# EAGLE schematic EPS (EAGLE 9.6.2)

## Sheet 1 of 3
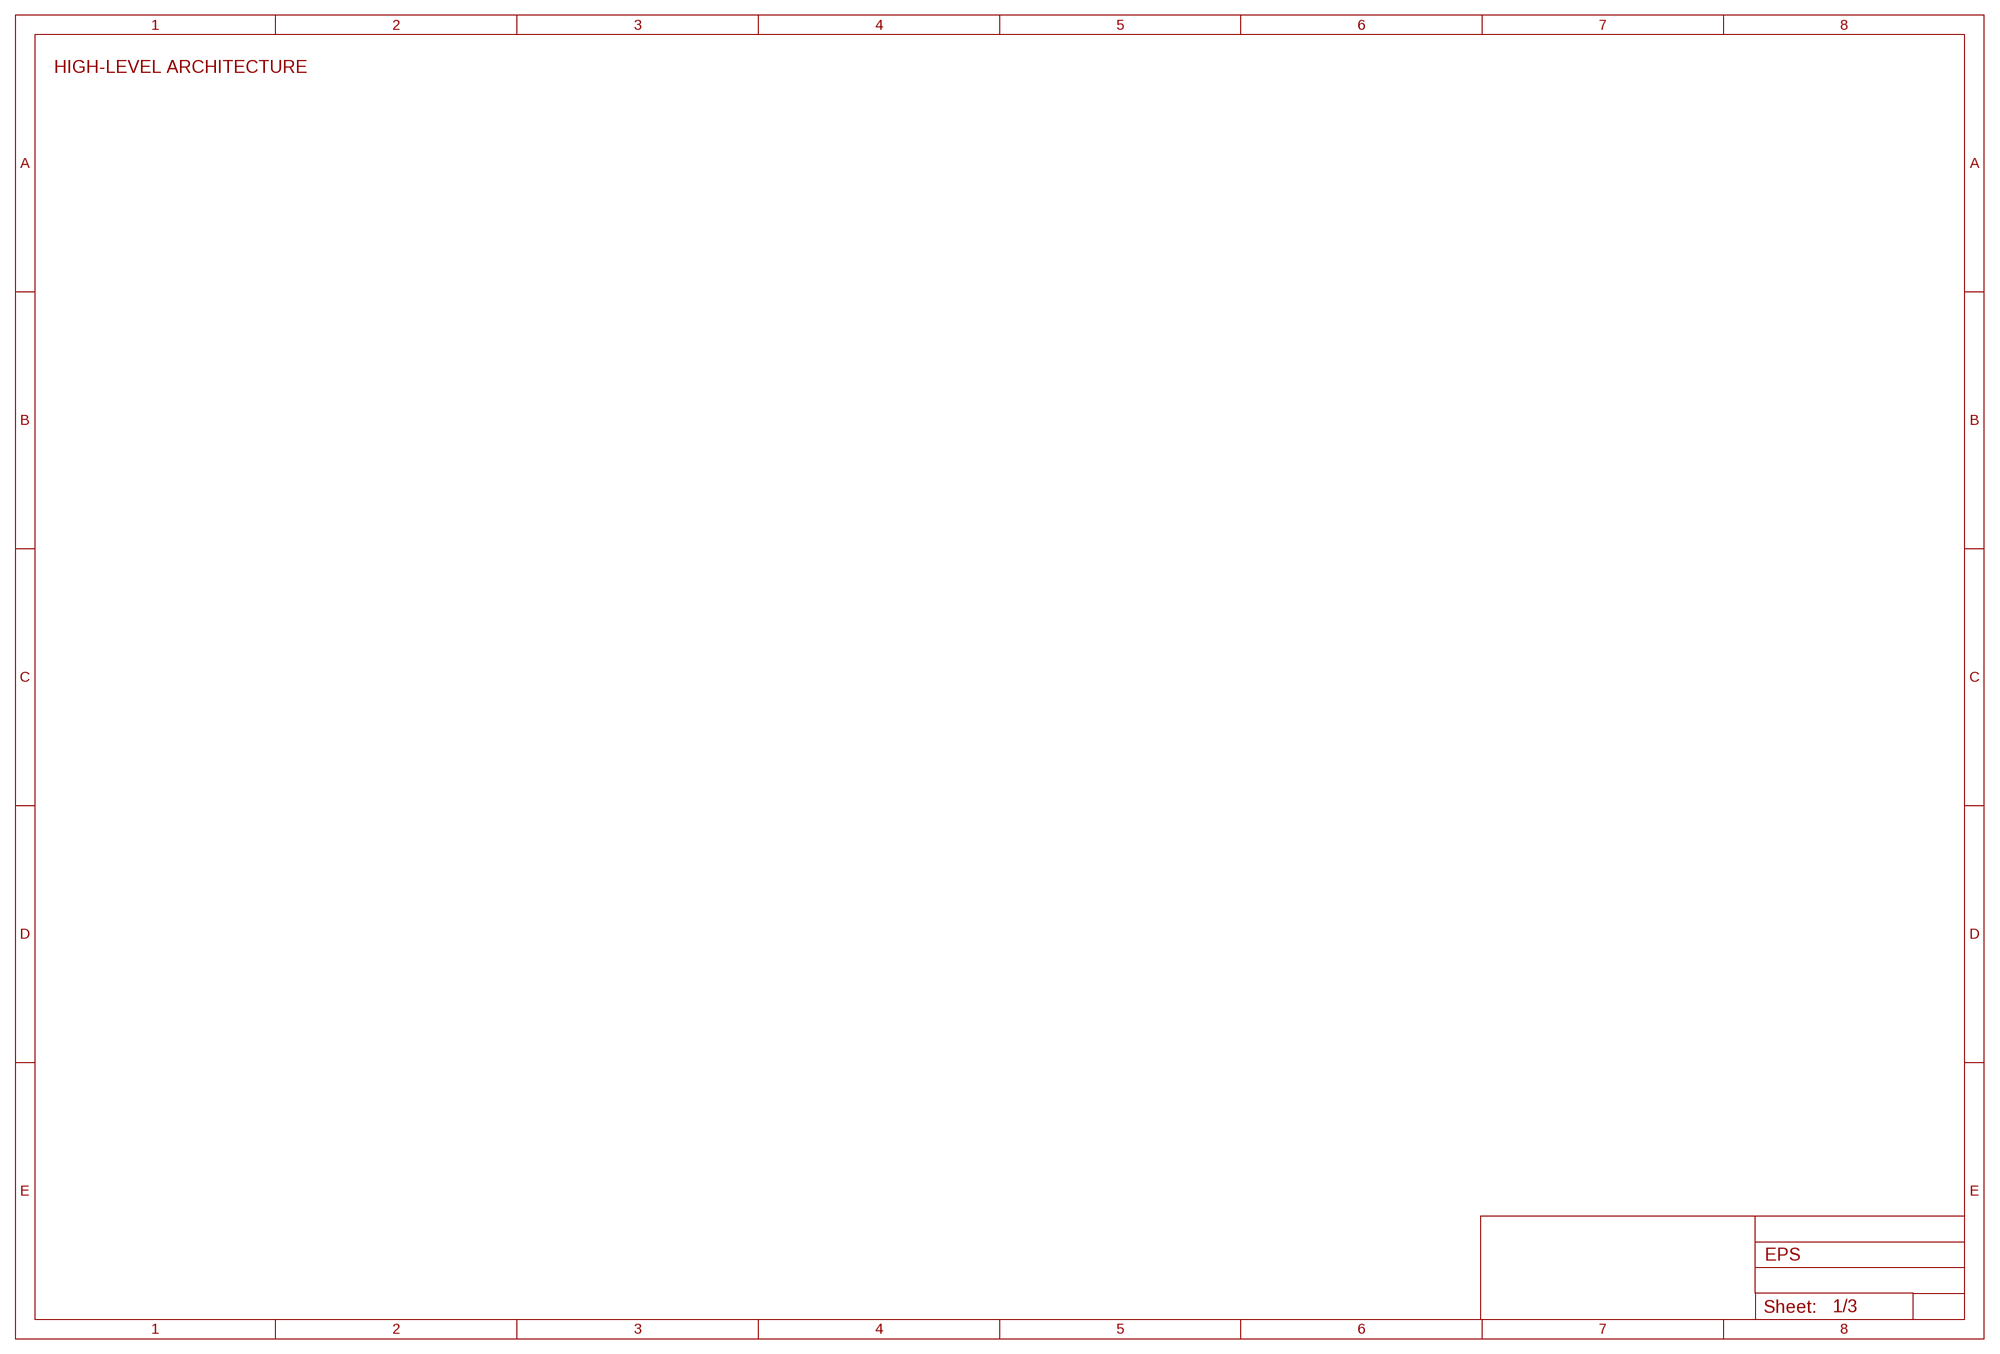
[diagram p0: schematic, sheet 1]

### Notes on the sheet
- HIGH-LEVEL ARCHITECTURE

## Sheet 2 of 3
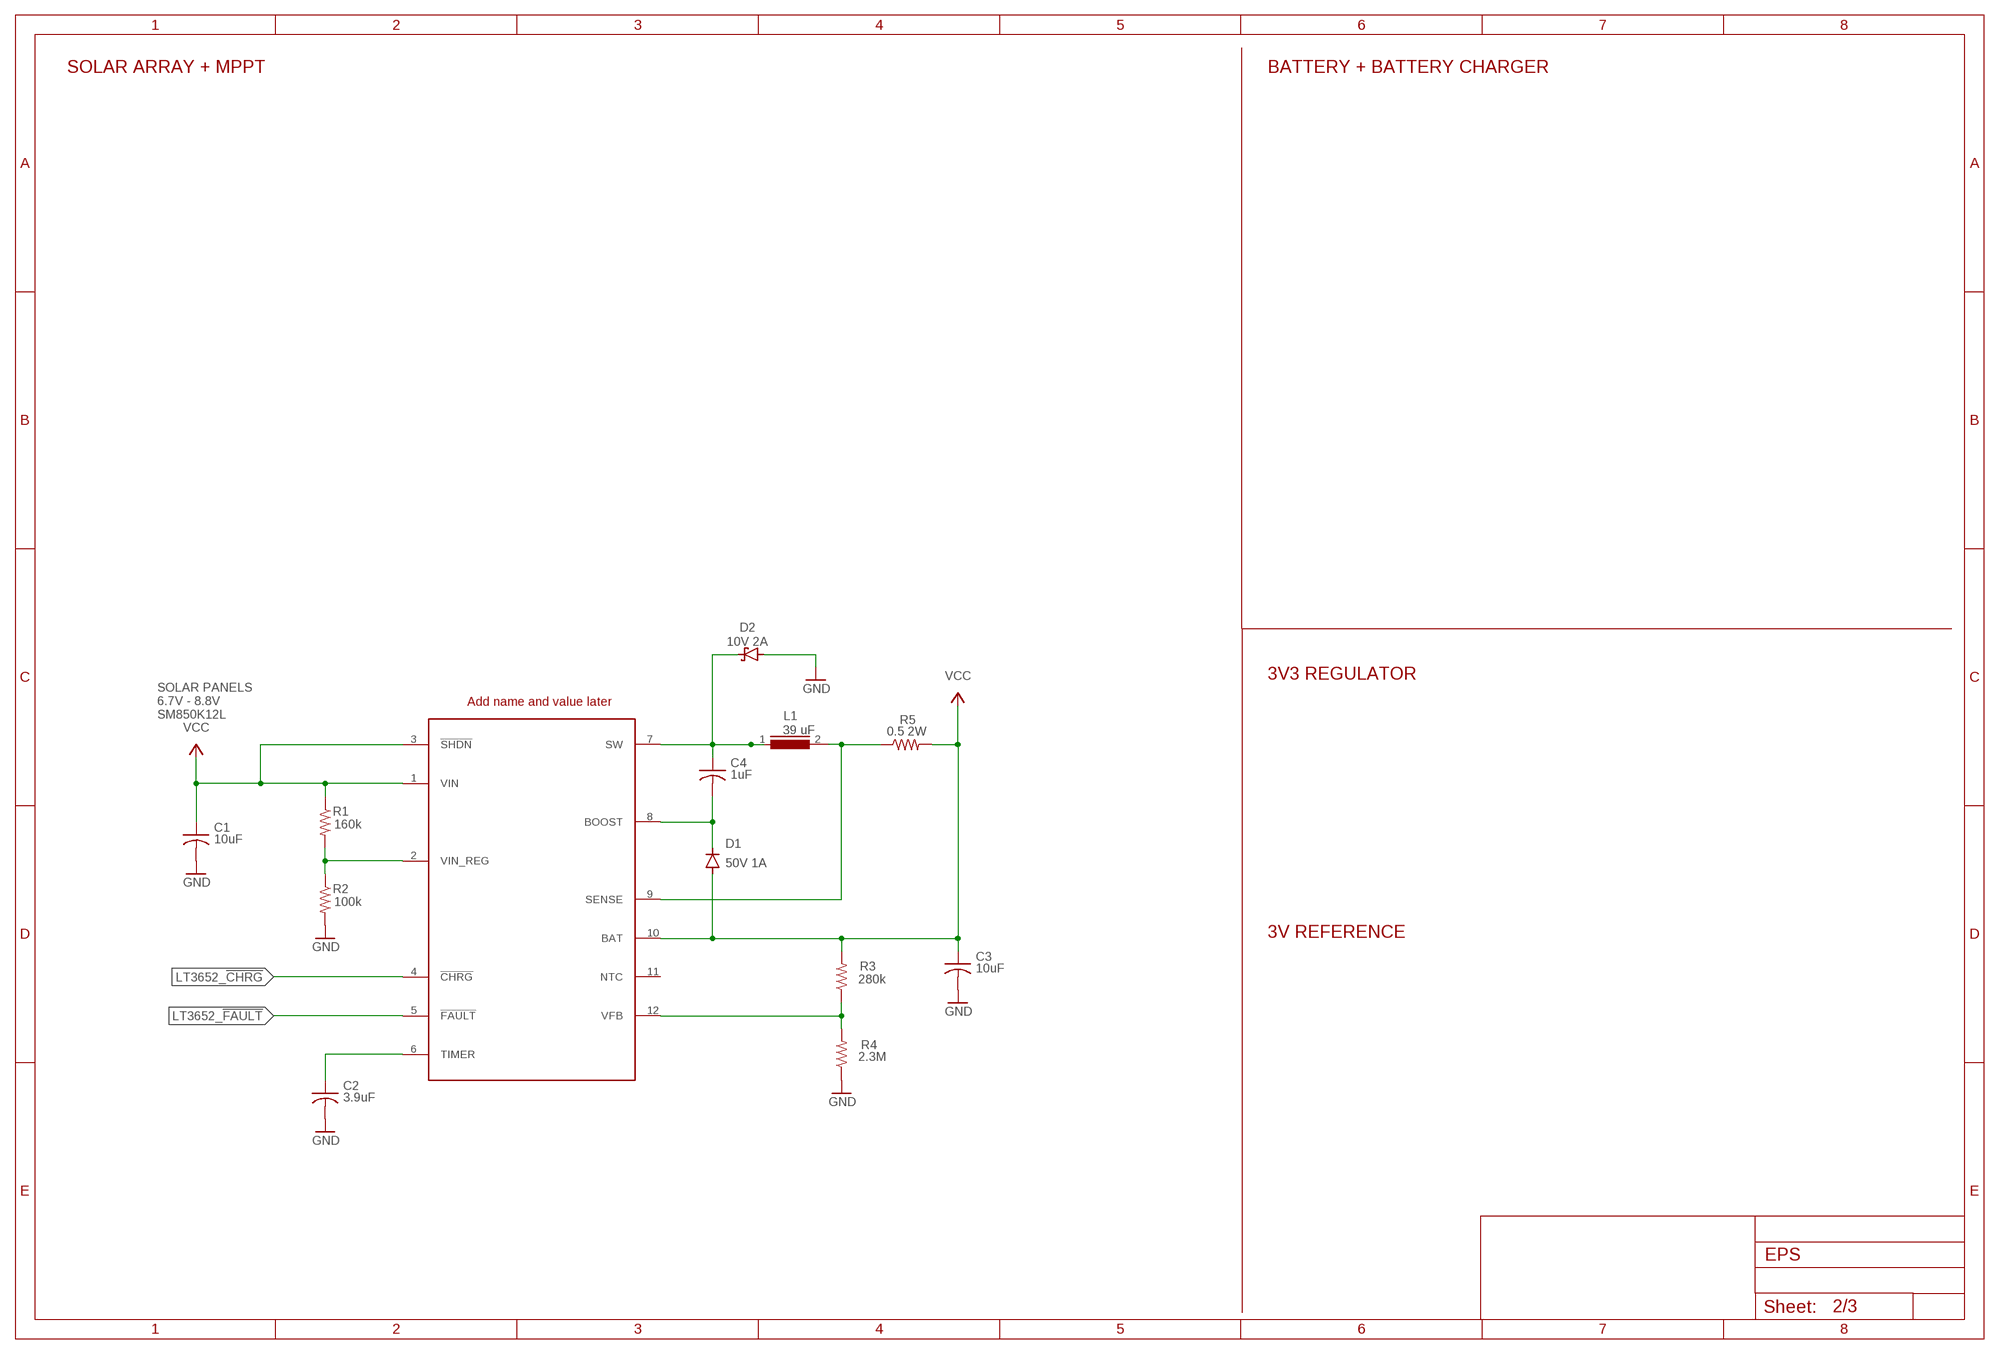
[diagram p1: schematic, sheet 2]

### Parts
C1  10uF  C-USC0603  [C0603]
C2  3.9uF  C-USC0603  [C0603]
C3  10uF  C-USC0603  [C0603]
C4  1uF  C-USC0603  [C0603]
D1  50V 1A  GF1  [SMA-DO214AC]
D2  10V 2A  BAT60J  [SOD323_ST]
L1  39 uF  B82132  [SUKW2-22]
R1  160k  R-US_R0603  [R0603]
R2  100k  R-US_R0603  [R0603]
R3  280k  R-US_R0603  [R0603]
R4  2.3M  R-US_R0603  [R0603]
R5  0.5 2W  R-US_R2512W  [R2512W]
U$1  LT3652  [LT3652]

### Nets
GND: C1.2 C2.2 C3.2 D2.A R2.2 R4.1
LT3652_!CHRG: U$1.4(!CHRG)
LT3652_!FAULT: U$1.5(!FAULT)
N$1: R1.2 R2.1 U$1.2(VIN_REG)
N$2: R3.1 R4.2 U$1.12(VFB)
N$3: C2.1 U$1.6(TIMER)
N$5: L1.2 R5.1 U$1.9(SENSE)
N$6: C4.2 D1.K(C) U$1.8(BOOST)
N$7: C4.1 D2.C L1.1 U$1.7(SW)
VCC: C1.1 C3.1 D1.A R1.1 R3.2 R5.2 U$1.1(VIN) U$1.3(!SHDN) U$1.10(BAT)
Unconnected: U$1.11(NTC)

### Notes on the sheet
- SOLAR ARRAY + MPPT | BATTERY + BATTERY CHARGER
- 3V3 REGULATOR
- Add name and value later
- SOLAR PANELS
  6.7V - 8.8V
  SM850K12L
- 3V REFERENCE

## Sheet 3 of 3
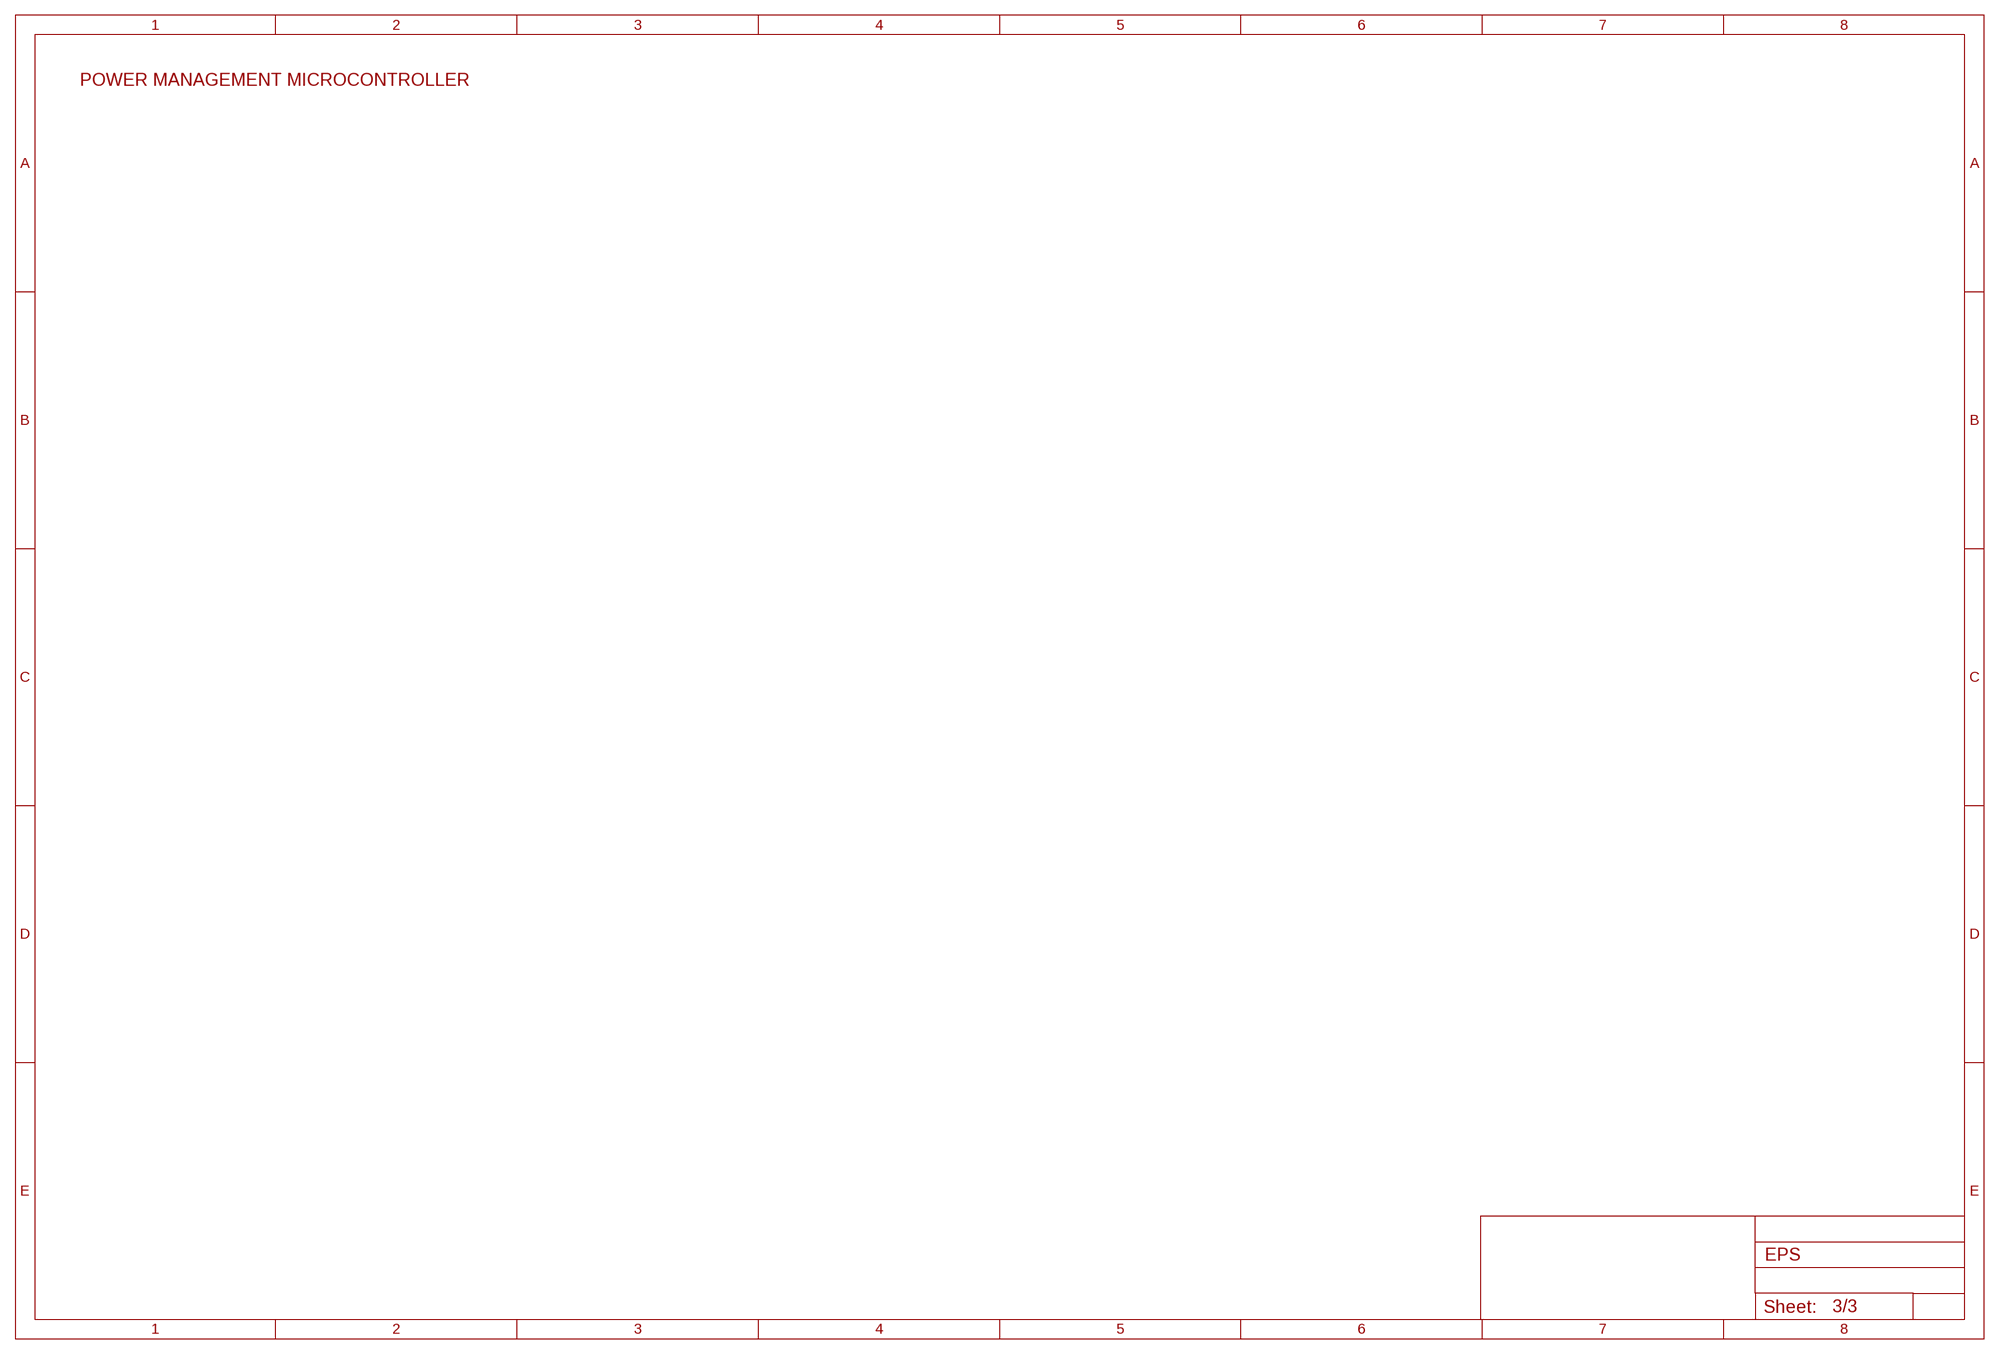
[diagram p2: schematic, sheet 3]

### Notes on the sheet
- POWER MANAGEMENT MICROCONTROLLER

## Library data of the parts
C1-C4 = rcl:C-US: CAPACITOR, American symbol; SPICEPREFIX: C
D1 = diode:GF1: DIODE
D2 = diode:BAT60J: Schottky barrier diode Source: www.st.com, BAT60J.pdf
L1 = inductors:B82132: INDUCTOR; SPICEPREFIX: L
R1-R5 = rcl:R-US_: RESISTOR, American symbol; SPICEPREFIX: R
U$1 = cube-sat:LT3652: Battery Charger; DISTPART: 505-LT3652IMSE#PBF-ND; DISTRIBUTOR: Digi-Key; MANUFACTURER: Linear Technology; MFGPART: LT3652IMSE#PBF